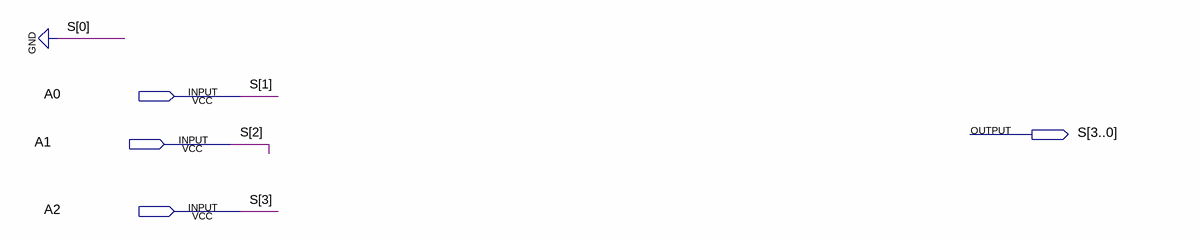
[diagram p0: schematic sheet]
// Quartus schematic Multi.bdf as structural Verilog: 0 symbols, 4 pins
module Multi (
  input  A0,
  input  A1,
  input  A2,
  output [3:0] S
);


  assign S = {A2, A1, A0, 1'b0};
endmodule
